# Altium project ROV_PCB_PWR.PrjPcb
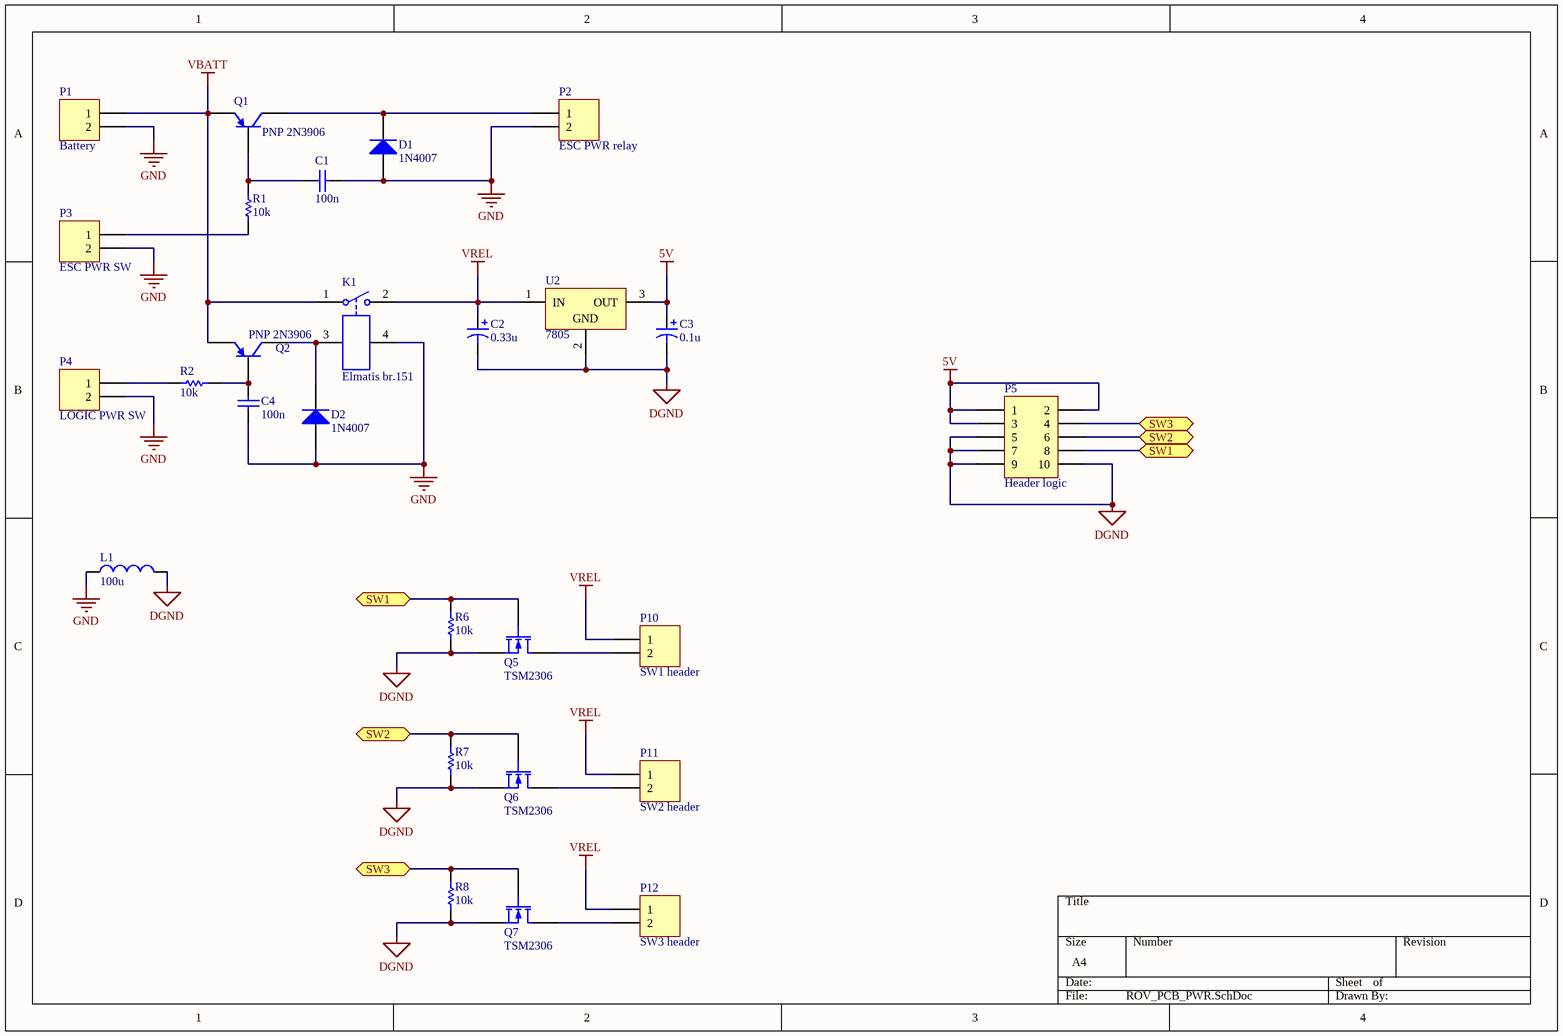
[diagram p0: ROV_PCB_PWR.SchDoc]
1 sheet, 27 parts. Net scope: flat (ports and power ports of the same name join across sheets).
Board file: ROV_PCB_PWR.PcbDoc

## Sheet ROV_PCB_PWR.SchDoc
size A4

### Parts
C1  100n  [RAD-0.1]
C2  0.33u  [ELKO200]
C3  0.1u  [ELKO200]
C4  100n  [RAD-0.1]
D1  1N4007  [DO-41]
D2  1N4007  [DO-41]
K1  Elmatis br.151  [REL151]
L1  100u  [AXIAL-0.5]
P1  Battery  [Klema]
P2  ESC PWR relay  [Klema]
P3  ESC PWR SW  [HDR1X2]
P4  LOGIC PWR SW  [HDR1X2]
P5  Header logic  [HDR2X5]
P10  SW1 header  [Klema]
P11  SW2 header  [Klema]
P12  SW3 header  [Klema]
Q1  PNP 2N3906  [MHDR1X3]
Q2  PNP 2N3906  [MHDR1X3]
Q5  TSM2306  [SOT-23_M]
Q6  TSM2306  [SOT-23_M]
Q7  TSM2306  [SOT-23_M]
R1  10k  [AXIAL-0.3]
R2  10k  [AXIAL-0.3]
R6  10k  [AXIAL-0.3]
R7  10k  [AXIAL-0.3]
R8  10k  [AXIAL-0.3]
U2  7805  [TO-220-AB]

### Ports
SW1, SW2, SW3

### Nets
5V: C3.1 P5.1 P5.2 P5.3 U2.3(OUT)
DGND: C2.2 C3.2 L1.2 P5.5 P5.7 P5.9 P5.10 Q5.2(S) Q6.2(S) Q7.2(S) R6.1 R7.1 R8.1 U2.2(GND)
GND: C1.1 C4.1 D1.1(A) D2.1(A) K1.4 L1.1 P1.2 P2.2 P3.2 P4.2
VBATT: K1.1 P1.1 Q1.1(E) Q2.1(E)
VREL: C2.1 K1.2 P10.1 P11.1 P12.1 U2.1(IN)
NetC1_2: C1.2 Q1.2(B) R1.2
NetC4_2: C4.2 Q2.2(B) R2.1
NetD1_2: D1.2(K) P2.1 Q1.3(C)
NetD2_2: D2.2(K) K1.3 Q2.3(C)
NetP3_1: P3.1 R1.1
NetP4_1: P4.1 R2.2
NetP5_4: P5.4 Q7.1(G) R8.2 ; port SW3
NetP5_6: P5.6 Q6.1(G) R7.2 ; port SW2
NetP5_8: P5.8 Q5.1(G) R6.2 ; port SW1
NetP10_2: P10.2 Q5.3(D)
NetP11_2: P11.2 Q6.3(D)
NetP12_2: P12.2 Q7.3(D)

### Library data of the parts
C1 = Cap: Capacitor; Value: 100pF; Published: 8-Jun-2000; LatestRevisionDate: 17-Jul-2002; LatestRevisionNote: Re-released for DXP Platform.; PackageReference: RAD-0.3; Publisher: Altium Limited; PackageDescription: Radial Cap, Thru-Hole; 2 Leads; 0.3 in Pin Spacing
C2 = Cap Pol1: Polarized Capacitor (Radial); Part number: C2006; Value: 100pF; Published: 8-Jun-2000; LatestRevisionDate: 17-Jul-2002; LatestRevisionNote: Re-released for DXP Platform.; PackageReference: RB7.6-15; Publisher: Altium Limited; PackageDescription: Polarized Capacitor (Radial); 2 Leads; Unit price: 0.94 kn; Supplier: Kronos
C3 = Cap Pol1: Polarized Capacitor (Radial); Part number: ELKO100/ 35; Value: 100pF; Published: 8-Jun-2000; LatestRevisionDate: 17-Jul-2002; LatestRevisionNote: Re-released for DXP Platform.; PackageReference: RB7.6-15; Publisher: Altium Limited; PackageDescription: Polarized Capacitor (Radial); 2 Leads; Supplier: Elmatis; Unit price: 0.70 kn
C4 = Cap: Capacitor; Part number: C5019; Value: 100pF; Published: 8-Jun-2000; LatestRevisionDate: 17-Jul-2002; LatestRevisionNote: Re-released for DXP Platform.; PackageReference: RAD-0.3; Publisher: Altium Limited; PackageDescription: Radial Cap, Thru-Hole; 2 Leads; 0.3 in Pin Spacing; Supplier: Kronos; Unit price: 1,23 kn
D1 D2 = Diode 1N4007: 1 Amp General Purpose Rectifier; Published: 8-Jun-2000; LatestRevisionDate: 17-Jul-2002; LatestRevisionNote: Re-released for DXP Platform.; DatasheetVersion: 1998; PackageVersion: Aug-1999; PackageReference: DO-41; Publisher: Altium Limited; PackageDescription: Diode, Axial; Body 5.2 x 2.7 mm (LxDia. max), Lead Dia. 0.86 mm (max); Code_JEDEC: DO-204-AL; ComponentLink1Description: Manufacturer Link; ComponentLink1URL: http://www.fairchildsemi.com/; ComponentLink2Description: Datasheet; ComponentLink2URL: http://www.fairchildsemi.com/ds/1N%2F1N4001.pdf
K1 = Relay-SPST: Single-Pole Single-Throw Relay; Part Number: 151; Spool R: 225; Spool voltage: 9; Published: 24-Mar-1999; LatestRevisionDate: 17-Jul-2002; LatestRevisionNote: Re-released for DXP Platform.; PackageReference: MODULE4; Publisher: Altium Limited; Supplier: Elmatis; Unit Price: 24 kn
L1 = Inductor: Part number: BL016; Code_IEC: 1005; Value: 10mH; Published: 8-Jun-2000; LatestRevisionDate: 29-May-2009; LatestRevisionNote: IPC-7351 Footprint Added.; PackageReference: 0402-A; Publisher: Altium Limited; PackageDescription: Chip Inductor; Code_JEITA: 0402; Supplier: Kronos; Unit price: 2.38 kn
P1-P4 P10-P12 = Header 2: Header, 2-Pin; LatestRevisionDate: 17-Jul-2002; LatestRevisionNote: Re-released for DXP Platform.; Publisher: Altium Limited
P5 = Header 5X2: Header, 5-Pin, Dual row; LatestRevisionDate: 17-Jul-2002; LatestRevisionNote: Re-released for DXP Platform.; Publisher: Altium Limited
Q1 Q2 = PNP: PNP Bipolar Transistor; Published: 8-Jun-2000; LatestRevisionDate: 29-May-2009; LatestRevisionNote: IPC-7351 Footprint Added.; PackageVersion: Aug-1999; PackageReference: SOT-23B; Publisher: Altium Limited; PackageDescription: 3-Pin SOT-23 Package 0.95 mm Pitch, 2.4 mm Lead Span; Supplier: Kronos; Unit price: 0.50 kn
Q5-Q7 = MOSFET-N: Published: 8-Jun-2000; LatestRevisionDate: 17-Jul-2002; LatestRevisionNote: Re-released for DXP Platform.; PackageVersion: 1995/1996; PackageReference: E3; Publisher: Altium Limited; PackageDescription: TO, Flat Index; 3 In-Line, Axial Leads; Body Dia. 4.6mm; Lead Dia. 0.5 mm (max); Supplier: Elmatis; Unit price: 2.80 kn
R1 R2 R6-R8 = Res1: Resistor; Value: 1K; Published: 8-Jun-2000; LatestRevisionDate: 17-Jul-2002; LatestRevisionNote: Re-released for DXP Platform.; PackageReference: AXIAL-0.3; Publisher: Altium Limited; PackageDescription: Axial Device, Thru-Hole; 2 Leads; 0.3 in Pin Spacing
U2 = µA7805CKC: Positive-Voltage Regulator; Note: Pin 2 is electrically connected to TAB.; Published: 15-Apr-2002; DatasheetVersion: Jul-1999; PackageVersion: Sep-1995; PackageReference: KC03; Publisher: Altium Limited; PackageDescription: TO, Thru-Hole, Vertical, Heatsink Mounted; 3 In-Line Leads; Pitch 2.54 mm; ComponentLink1Description: Manufacturer Link; ComponentLink1URL: http://www.ti.com/; ComponentLink2Description: Datasheet; ComponentLink2URL: http://www-s.ti.com/sc/ds/ua7805.pdf; Unit price: 5.00 kn; Supplier: Elmatis